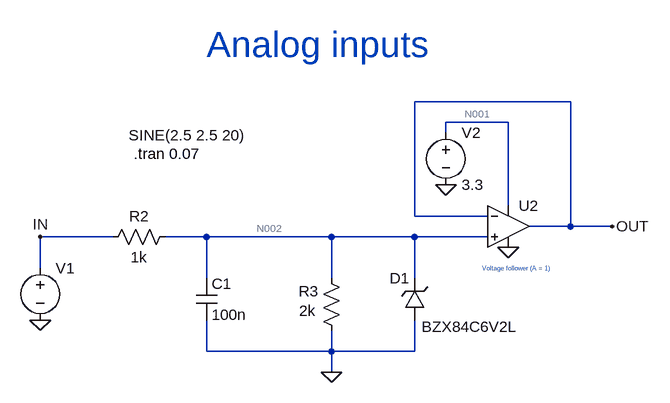
[diagram p0: schematic analog_input.asc]
analog_input.asc, the LTspice schematic file:
Version 4
SHEET 1 1524 680
WIRE 848 -160 608 -160
WIRE 752 -128 656 -128
WIRE 656 -112 656 -128
WIRE 752 0 752 -128
WIRE 608 16 608 -160
WIRE 720 16 608 16
WIRE 848 32 848 -160
WIRE 848 32 784 32
WIRE 912 32 848 32
WIRE 144 48 32 48
WIRE 288 48 224 48
WIRE 480 48 288 48
WIRE 608 48 480 48
WIRE 720 48 608 48
WIRE 32 96 32 48
WIRE 288 112 288 48
WIRE 480 112 480 48
WIRE 608 112 608 48
WIRE 288 224 288 176
WIRE 480 224 480 192
WIRE 480 224 288 224
WIRE 608 224 608 176
WIRE 608 224 480 224
WIRE 480 256 480 224
FLAG 32 176 0
FLAG 752 64 0
FLAG 656 -32 0
FLAG 480 256 0
FLAG 912 32 OUT
FLAG 32 48 IN
SYMBOL voltage 32 80 R0
WINDOW 3 136 -188 Left 2
WINDOW 123 24 124 Left 2
WINDOW 39 0 0 Left 0
SYMATTR Value SINE(2.5 2.5 20)
SYMATTR InstName V1
SYMBOL voltage 656 -128 R0
WINDOW 123 0 0 Left 0
WINDOW 39 0 0 Left 0
SYMATTR InstName V2
SYMATTR Value 3.3
SYMBOL res 240 32 R90
WINDOW 0 0 56 VBottom 2
WINDOW 3 32 56 VTop 2
SYMATTR InstName R2
SYMATTR Value 1k
SYMBOL res 496 208 R180
WINDOW 0 36 76 Left 2
WINDOW 3 40 46 Left 2
SYMATTR InstName R3
SYMATTR Value 2k
SYMBOL cap 272 112 R0
SYMATTR InstName C1
SYMATTR Value 100n
SYMBOL zener 624 176 R180
WINDOW 0 24 64 Left 2
WINDOW 3 -142 -10 Left 2
SYMATTR InstName D1
SYMATTR Value BZX84C6V2L
SYMBOL OpAmps\\UniversalOpamp2 752 32 R0
SYMATTR InstName U2
TEXT 176 -80 Left 2 !.tran 0.07
TEXT 288 -248 Left 5 ;Analog inputs
TEXT 712 96 Left 0 ;Voltage follower (A = 1)

The netlist it stands for:
* analog_input.asc
V1 IN 0 SINE(2.5 2.5 20)
V2 N001 0 3.3
R2 N002 IN 1k
R3 0 N002 2k
C1 N002 0 100n
D1 0 N002 BZX84C6V2L
XU2 N002 OUT N001 0 OUT level.2 Avol=1Meg GBW=10Meg Slew=10Meg ilimit=25m rail=0 Vos=0 phimargin=45 en=0 enk=0 in=0 ink=0 Rin=500Meg  ; pins IN+ IN- V+ V- OUT
.model D D
.lib standard.dio
.tran 0.07
* Analog inputs
* Voltage follower (A = 1)
.lib UniversalOpamps2.sub
.backanno
.end

* Results of the author's LTspice run, read from the files saved beside the schematic
* Operating Point, zero values left out:
*   V(in) = 2.5 V
*   V(n001) = 3.3 V
*   V(n002) = 1.667 V
*   V(out) = 1.667 V
*   I(D1) = -1.502 nA
*   I(R3) = -833.3 µA
*   I(R2) = -833.3 µA
*   I(V2) = -165 µA
*   I(V1) = -833.3 µA
*   Ix(u2:1) = 33.33 pA
*   Ix(u2:2) = 33.33 pA
*   Ix(u2:3) = 165 µA
*   Ix(u2:4) = -165 µA
*   Ix(u2:5) = -33.33 pA
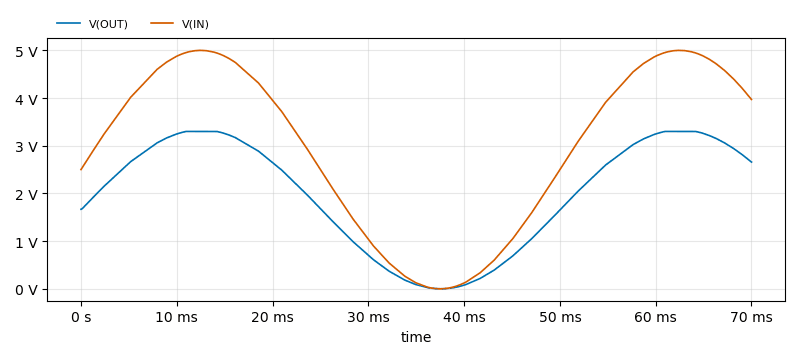
[diagram p1: Transient Analysis of analog_input.asc, plotted from the saved traces]
* Transient Analysis, 1 run:
*   V(OUT): min 81.66 µV, max 3.3 V, average 2.005 V, rms 2.317 V, last 2.658 V
*   V(IN): min 1 µV, max 5 V, average 3.012 V, rms 3.482 V, last 3.969 V